# Altium schematic sheet RFCtl.SchDoc
size 420 x 297 mm; Address1: Address1; Address2: Address2; Address3: Address3; Address4: Address4; SheetNumber: 1; Scale: 1:1; Разраб.: Иванов; Обозначение документа: АБВГ.123456.001 Э3; Пров.: Петров; Утв.: Сидоров; Наименование организации: ОАО "Концерн "МПО-Гидроприбор"; Перв. применение: АБВГ.123456.000; Наименование изделия 1: Плата; Наименование изделия 2: Схема электрическая; Наименование изделия 3: принципиальная; Нач. отд.: Нач. отд.; Фамилия нач. отд.: Сидоров
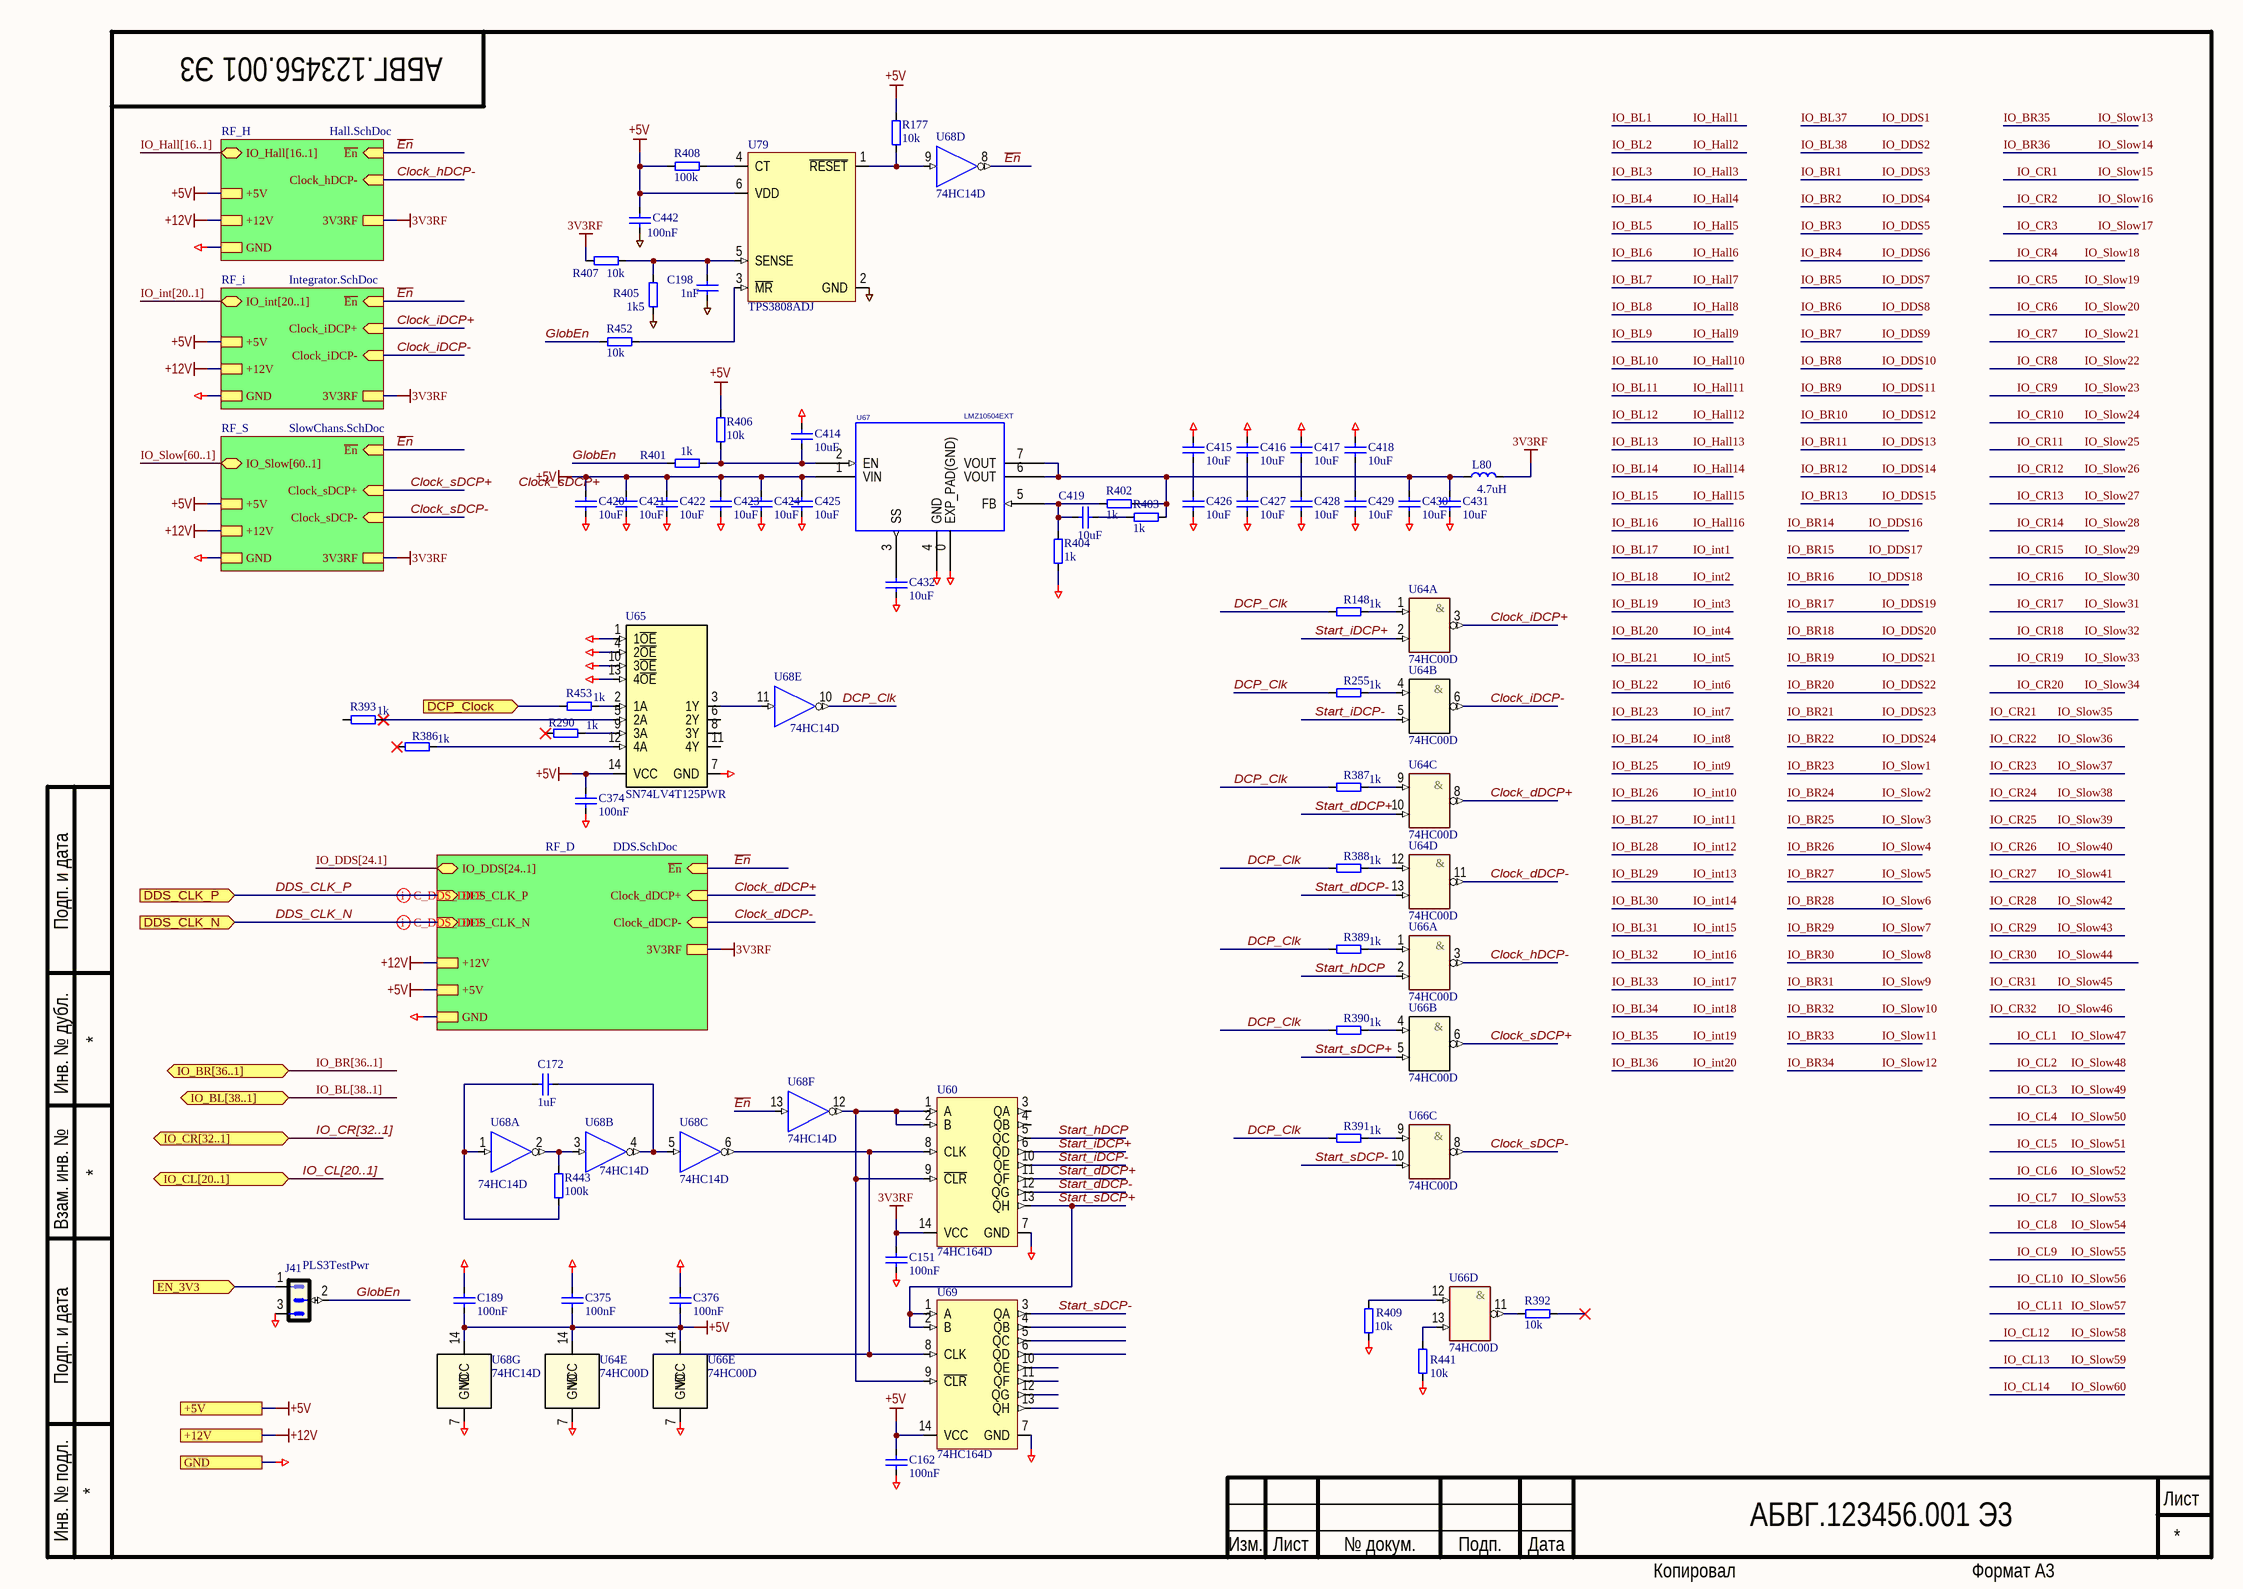
[diagram p0: RFCtl.SchDoc]

## Parts
C151  100nF  [SMD0805CAP]
C162  100nF  [SMD0805CAP]
C172  1uF  [SMD0805CAP]
C189  100nF  [SMD0805CAP]
C198  1nF  [SMD0805CAP]
C374  100nF  [SMD0805CAP]
C375  100nF  [SMD0805CAP]
C376  100nF  [SMD0805CAP]
C414  10uF  [SMD0805CAP]
C415  10uF  [SMD0805CAP]
C416  10uF  [SMD0805CAP]
C417  10uF  [SMD0805CAP]
C418  10uF  [SMD0805CAP]
C419  10uF  [SMD0805CAP]
C420  10uF  [SMD0805CAP]
C421  10uF  [SMD0805CAP]
C422  10uF  [SMD0805CAP]
C423  10uF  [SMD0805CAP]
C424  10uF  [SMD0805CAP]
C425  10uF  [SMD0805CAP]
C426  10uF  [SMD0805CAP]
C427  10uF  [SMD0805CAP]
C428  10uF  [SMD0805CAP]
C429  10uF  [SMD0805CAP]
C430  10uF  [SMD0805CAP]
C431  10uF  [SMD0805CAP]
C432  10uF  [SMD0805CAP]
C442  100nF  [SMD0805CAP]
J41  PLS3TestPwr  [PLS3]
L80  value 4.7uH  [IND_3225_MURATA_LQH_N]  (hidden comment: LQH32PN4R7NN0L)
R148  1k  [SMD0805RES]
R177  10k  [SMD0805RES]
R255  1k  [SMD0805RES]
R290  1k  [SMD0805RES]
R386  1k  [SMD0805RES]
R387  1k  [SMD0805RES]
R388  1k  [SMD0805RES]
R389  1k  [SMD0805RES]
R390  1k  [SMD0805RES]
R391  1k  [SMD0805RES]
R392  10k  [SMD0805RES]
R393  1k  [SMD0805RES]
R401  1k  [SMD0805RES]
R402  1k  [SMD0805RES]
R403  1k  [SMD0805RES]
R404  1k  [SMD0805RES]
R405  1k5  [SMD0805RES]
R406  10k  [SMD0805RES]
R407  10k  [SMD0805RES]
R408  100k  [SMD0805RES]
R409  10k  [SMD0805RES]
R441  10k  [SMD0805RES]
R443  100k  [SMD0805RES]
R452  10k  [SMD0805RES]
R453  1k  [SMD0805RES]
U60  74HC164D  [SOIC127P600X175-14N]
U64  74HC00D  [SOIC127P600X175-14N]  (parts A,B,C,D,E of 5)
U65  SN74LV4T125PWR  [SOP65P640X120-14N]
U66  74HC00D  [SOIC127P600X175-14N]  (parts A,B,C,D,E of 5)
U67  LMZ10504EXT  [TO-PMOD7]
U68  74HC14D  [SOIC127P600X175-14N]  (parts A,B,C,D,E,F,G of 7)
U69  74HC164D  [SOIC127P600X175-14N]
U79  TPS3808ADJ  [SOT95P270X145-6N]

## Sub-sheets
RF_D = DDS.SchDoc: IO_DDS[24..1] (bidir), ~{En} (in), Clock_dDCP- (in), Clock_dDCP+ (in), DDS_CLK_N (in), DDS_CLK_P (in), GND, +5V, 3V3RF, +12V
RF_H = Hall.SchDoc: IO_Hall[16..1] (bidir), ~{En} (in), Clock_hDCP- (in), GND, +12V, +5V, 3V3RF
RF_i = Integrator.SchDoc: IO_int[20..1] (bidir), ~{En} (in), Clock_iDCP- (in), Clock_iDCP+ (in), GND, +12V, +5V, 3V3RF
RF_S = SlowChans.SchDoc: IO_Slow[60..1] (bidir), ~{En} (in), Clock_sDCP- (in), Clock_sDCP+ (in), +5V, +12V, GND, 3V3RF

## Ports
+5V, +12V, DCP_Clock (in), DDS_CLK_N (in), DDS_CLK_P (in), EN_3V3 (in), GND, IO_BL[38..1] (bidir), IO_BR[36..1] (bidir), IO_CL[20..1] (bidir), IO_CR[32..1] (bidir)

## Nets
3V3RF: C151.2 L80.2 R407.1 U60.14(VCC) ; sheet RF_H/3V3RF, sheet RF_i/3V3RF, sheet RF_D/3V3RF, sheet RF_S/3V3RF
+5V: C162.2 C189.1 C374.2 C375.1 C376.1 C420.2 C421.2 C422.2 C423.2 C424.2 C425.2 C442.2 R177.1 R406.2 R408.1 U64.14(VCC) U65.14(VCC) U66.14(VCC) U67.1(VIN) U68.14(VCC) U69.14(VCC) U79.6(VDD) ; port +5V, sheet RF_H/+5V, sheet RF_i/+5V, sheet RF_D/+5V, sheet RF_S/+5V
+12V: port +12V, sheet RF_H/+12V, sheet RF_i/+12V, sheet RF_D/+12V, sheet RF_S/+12V
GND: C151.1 C162.1 C189.2 C198.1 C374.1 C375.2 C376.2 C414.2 C415.2 C416.2 C417.2 C418.2 C420.1 C421.1 C422.1 C423.1 C424.1 C425.1 C426.1 C427.1 C428.1 C429.1 C430.1 C431.1 C432.1 C442.1 J41.3 R404.2 R405.1 R409.1 R441.1 U60.7(GND) U64.7(GND) U65.1(1~{OE}) U65.4(2~{OE}) U65.7(GND) U65.10(3~{OE}) U65.13(4~{OE}) U66.7(GND) U67.0(EXP_PAD(GND)) U67.4(GND) U68.7(GND) U69.7(GND) U79.2(GND) ; port GND, sheet RF_H/GND, sheet RF_i/GND, sheet RF_D/GND, sheet RF_S/GND
~{En}: U68.8(OUT) U68.13(IN) ; sheet RF_H/~{En}, sheet RF_i/~{En}, sheet RF_D/~{En}, sheet RF_S/~{En}
Clock_dDCP+: U64.8(OUT) ; sheet RF_D/Clock_dDCP+
Clock_dDCP-: U64.11(OUT) ; sheet RF_D/Clock_dDCP-
Clock_hDCP-: U66.3(OUT) ; sheet RF_H/Clock_hDCP-
Clock_iDCP+: U64.3(OUT) ; sheet RF_i/Clock_iDCP+
Clock_iDCP-: U64.6(OUT) ; sheet RF_i/Clock_iDCP-
Clock_sDCP+: U66.6(OUT) ; sheet RF_S/Clock_sDCP+
Clock_sDCP-: U66.8(OUT) ; sheet RF_S/Clock_sDCP-
DCP_Clk: R148.2 R255.2 R387.2 R388.2 R389.2 R390.2 R391.2 U68.10(OUT)
DCP_Clock: R453.2 ; port DCP_Clock
DDS_CLK_N: port DDS_CLK_N, sheet RF_D/DDS_CLK_N
DDS_CLK_P: port DDS_CLK_P, sheet RF_D/DDS_CLK_P
EN_3V3: J41.1 ; port EN_3V3
GlobEn: J41.2 R401.2 R452.2
Start_dDCP+: U60.11(QF) U64.10(IN)
Start_dDCP-: U60.12(QG) U64.13(IN)
Start_hDCP: U60.5(QC) U66.2(IN)
Start_iDCP+: U60.6(QD) U64.2(IN)
Start_iDCP-: U60.10(QE) U64.5(IN)
Start_sDCP+: U60.13(QH) U66.5(IN) U69.1(A) U69.2(B)
Start_sDCP-: U66.10(IN) U69.3(QA)
NetC172_1: C172.1 U68.4(OUT) U68.5(IN)
NetC172_2: C172.2 R443.1 U68.1(IN)
NetC198_2: C198.2 R405.2 R407.2 U79.5(SENSE)
NetC414_1: C414.1 R401.1 R406.1 U67.2(EN)
NetC415_1: C415.1 C426.2
NetC416_1: C416.1 C427.2
NetC417_1: C417.1 C428.2
NetC418_1: C418.1 C429.2
NetC419_1: C419.1 R403.2
NetC419_2: C419.2 R402.2 R404.1 U67.5(FB)
NetC430_2: C430.2 C431.2 L80.1 R402.1 R403.1 U67.6(VOUT) U67.7(VOUT)
NetC432_2: C432.2 U67.3(SS)
NetR148_1: R148.1 U64.1(IN)
NetR177_2: R177.2 U68.9(IN) U79.1(~{RESET})
NetR255_1: R255.1 U64.4(IN)
NetR290_1: R290.1 U65.9(3A)
NetR386_1: R386.1 U65.12(4A)
NetR387_1: R387.1 U64.9(IN)
NetR388_1: R388.1 U64.12(IN)
NetR389_1: R389.1 U66.1(IN)
NetR390_1: R390.1 U66.4(IN)
NetR391_1: R391.1 U66.9(IN)
NetR392_2: R392.2 U66.11(OUT)
NetR393_1: R393.1 U65.5(2A)
NetR408_2: R408.2 U79.4(CT)
NetR409_2: R409.2 U66.12(IN)
NetR441_2: R441.2 U66.13(IN)
NetR443_2: R443.2 U68.2(OUT) U68.3(IN)
NetR452_1: R452.1 U79.3(~{MR})
NetR453_1: R453.1 U65.2(1A)
NetU60_1: U60.1(A) U60.2(B) U60.9(~{CLR}) U68.12(OUT) U69.9(~{CLR})
NetU60_8: U60.8(CLK) U68.6(OUT) U69.8(CLK)
NetU65_3: U65.3(1Y) U68.11(IN)

Not connected (* = marked no-connect by the designer): R290 2*; R386 2*; R392 1*; R393 2; U60 3(QA) 4(QB); U65 6(2Y) 8(3Y) 11(4Y); U69 4(QB) 5(QC) 6(QD) 10(QE) 11(QF) 12(QG) 13(QH)

## Buses and harness runs
bus IO_BL[38..1] = port IO_BL[38..1]
bus IO_BR[36..1] = port IO_BR[36..1]
bus IO_CL[20..1] = port IO_CL[20..1]
bus IO_CR[32..1] = port IO_CR[32..1]
bus IO_DDS[24.1] = sheet RF_D/IO_DDS[24..1]
bus IO_Hall[16..1] = sheet RF_H/IO_Hall[16..1]
bus IO_int[20..1] = sheet RF_i/IO_int[20..1]
bus IO_Slow[60..1] = sheet RF_S/IO_Slow[60..1]

## Layout directives
differential pair; rule Differential Pairs Routing [Pref Gap = 0.175mm    Min Gap  = 0.075mm    Max Gap  = 0.5mmPref Width = 0.25mm    Min Width  = 0.075mm    Max Width  = 0.5mm]: DDS_CLK_N, DDS_CLK_P

## Notes on the sheet
- Labels drawn without touching a wire or pin: Clock_sDCP+
- Подп. и дата
- Инв. № дубл.
- Взам. инв. №
- Инв. № подл.
- Изм.
- Лист
- № докум.
- Подп.
- Дата
- Копировал
- Формат А3
- (in symbol 74HC00D, part A) &
- (in symbol 74HC00D, part B) &
- (in symbol 74HC00D, part C) &
- (in symbol 74HC00D, part D) &

## Library data of the parts
C151 C162 C172 C189 C198 C374-C376 C442 = C0805: Чип конденсатор 0805; Voltage: 25V; Vendor: Vishay; DielectricType: X5R; SMD Solders: 2; Solder Option: RM; Tolerance: 20%; Pkg: SMD0805; Device: Cap0805; Price: 2
  C151 C162 C189 C374-C376 C442: Value: 100nF
  C172: Value: 1uF
  C198: Value: 1nF
C414-C432 = C0805: Чип конденсатор 0805; Pkg: SMD0805; Vendor: Vishay; SMD Solders: 2; Tolerance: 20%; Voltage: 25V; DielectricType: X5R; Solder Option: RM; Device: Cap0805; Value: 10uF; Price: 2
J41 = PLS3: Vendor: Confly; SMD Solders: 0; Solder Option: RM; THD Solders: 3; Price: 1; Value: TestPwr; Device: PLS3
L80 = LQH32PN4R7NN0L: Inductor, Fixed, 1210, 4.7uH, 216mOhm, 1A, 30%; Pkg: 1210; Vendor: Murata; Maintainer: Evgeniy Kotov; SMD Solders: 2; THD Solders: 0; DC Current: 750mA; Tolerance: 20%; DC Resistance: 380mΩ; PartField: LQH32PN4R7NN0L; Release Date: 30.03.2017; Last Change Data: 30.03.2017; Temperature Range: -40°C to +105°C
R148 R255 R290 R386-R391 R401-R404 = R0805: Чип резистор 0805; Pkg: SMD0805; Vendor: Vishay; SMD Solders: 2; Tolerance: 1%; Solder Option: RM; TC: 100ppm/C; Pwr: 125mW; Device: Res0805; Value: 1k; Price: 2
R177 R392 R393 R405-R407 R409 R441 R443 R452 R453 = R0805: Чип резистор 0805; Vendor: Vishay; SMD Solders: 2; Solder Option: RM; TC: 100ppm/C; Tolerance: 1%; Pkg: SMD0805; Pwr: 125mW; Device: Res0805; Price: 2
  R177 R392 R406 R407 R409 R441 R452: Value: 10k
  R393 R453: Value: 1k
  R405: Value: 1k5
  R443: Value: 100k
R408 = R0805: Чип резистор 0805; Vendor: Vishay; SMD Solders: 2; Solder Option: Dbg; TC: 100ppm/C; Tolerance: 1%; Pkg: SMD0805; Pwr: 125mW; Device: Res0805; Price: 2; Value: 100k
U60 U69 = 74HC164D: Сдвиговый регистр. Посл. вх. 8 разр. выход.; Pkg: SOIC14; SMD Solders: 14; Solder Option: RM; THD Solders: 0; Vendor: NXP; Voltage: 2V0.. 6V0; Device: 74HC164D; Price: 30; Name to order: 74HC164D
U64 U66 = 74HC00D: 4 лог. элемента 2И-НЕ; Vendor: NXP; Pkg: SOIC14; SMD Solders: 14; Solder Option: RM; Voltage: 2.. 6V; Price: 50; Device: 74HC00D; Name to order: 74HC00D
U65 = SN74LV4T125PWR: Quadruple Buffer Translator GATE With 3-State / Output CMOS Logic Level Shifter; Pkg: TSSOP14; SMD Solders: 14; Solder Option: RM; THD Solders: 0; Vendor: Texas Instruments; Voltage: 2V0.. 6V0; Device: SN74LV4T125PWR; Price: 30; Name to order: SN74LV4T125PWR
U67 = LMZ10504EXT_NDW: 4A, SIMPLE SWITCHER® Power Module with 5.5V Maximum Input Voltage for Military and Rugged Applications; Manufacturer: Texas Instruments; Manufacturer_Part_Number: lmz10504ext_ndw_7; NSC_PackageReference: TZA07A; Pkg: PMOD-7EP; SMD Solders: 8; THD Solders: 0; Value: LMZ10504EXT; HelpURL: http://www.ti.com/lit/ds/symlink/lmz10504ext.pdf; basePN: LMZ10504EXT; Vendor: Texas Instruments; PartField: LMZ10504EXT
U68 = 74HC14D: 6 триггеров Шмита с инверсией.; Vendor: NXP; Pkg: SOIC14; SMD Solders: 14; Solder Option: RM; Voltage: 2.. 6V; Price: 50; Device: 74HC14D; Name to order: 74HC14D
U79 = TPS3808: Supervisory Circuit. Low-Quiescent-Current, Programmable-Delay; Vendor: Texas Instruments; Value: ADJ; Pkg: SOT23-6; SMD Solders: 6; Solder Option: RM; THD Solders: 0; Name to order: TPS3808G01DBV; Current: 6uA; thVoltage: 400mV; Price: 200; Device: TPS3808